# EAGLE design UP_Aktor_1Wechsler_16A_V0.1 (EAGLE 6.4)
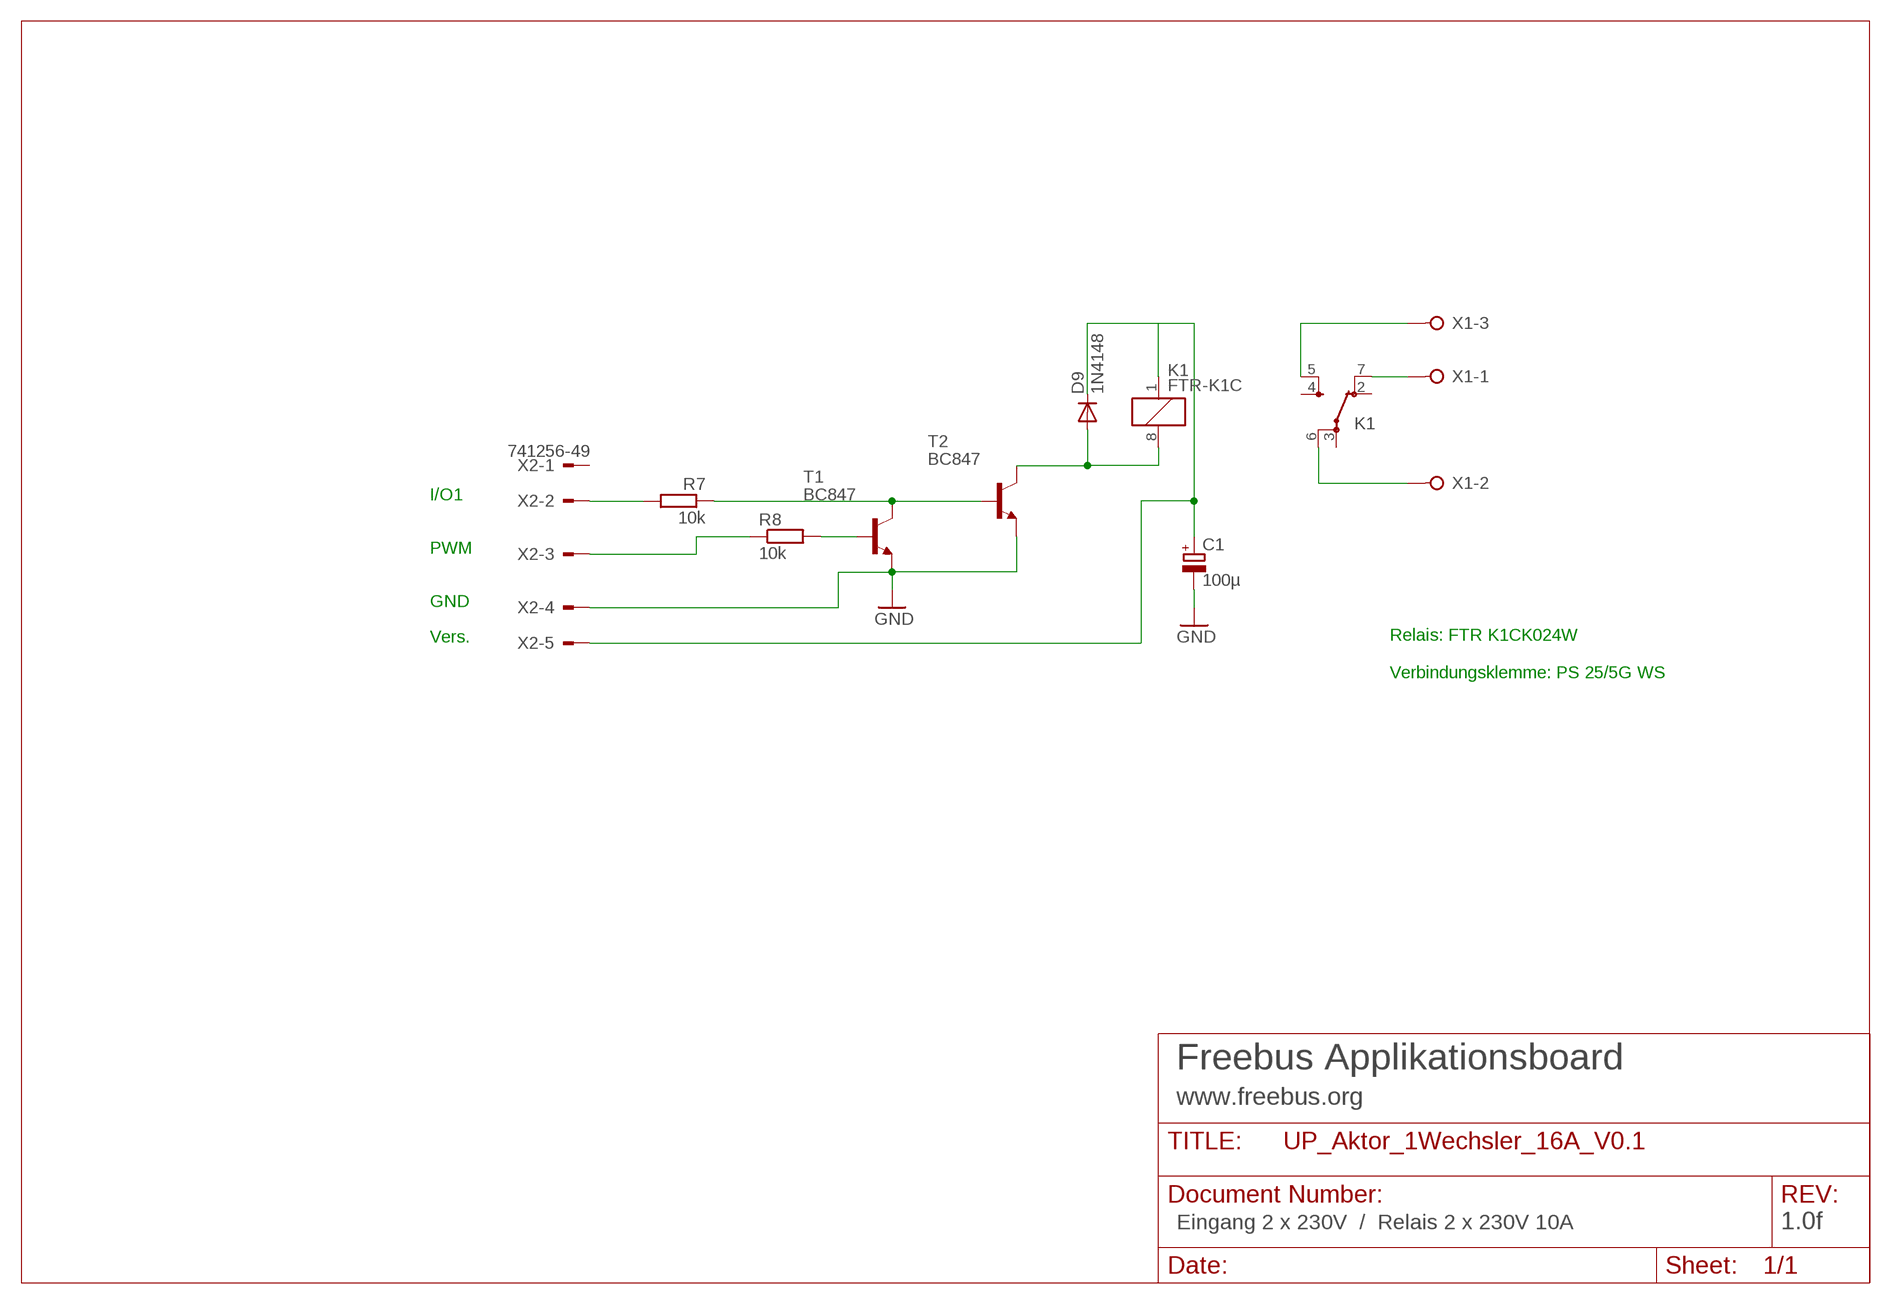
[diagram p0: schematic, sheet 1]

## Parts
C1  100µ  CPOL-EUE3.5-8  [E3,5-8]
D9  1N4148  DIODE-MINIMELF  [MINIMELF]
K1  FTR-K1C  [FTR-K1C]
R7  10k  R-EU_M1206  [M1206]
R8  10k  R-EU_M1206  [M1206]
T1  BC847  [SOT23]
T2  BC847  [SOT23]
X1  W237-03P  [W237-133]
X2  741256-49  [741256-49]

## Nets
GND: C1.- T1.2(E) T2.2(E) X2.4
IO2: R7.2 X2.2
N$1: K1.5(-1:SB) X1.3
N$2: K1.7(-1:OB) X1.1
N$3: K1.6(-1:PB) X1.2
N$7: R8.1 X2.3
N$14: R7.1 T1.3(C) T2.1(B)
N$21: R8.2 T1.1(B)
R3: D9.A K1.8 T2.3(C)
VDD_IN: C1.+ D9.C K1.1 X2.5
Unconnected: K1.2(-1:OA) K1.3(-1:PA) K1.4(-1:SA) X2.1

## Notes on the sheet
- I/O1
- PWM
- GND
- Vers.
- Relais: FTR K1CK024W
  
  Verbindungsklemme: PS 25/5G WS
- Freebus Applikationsboard
- www.freebus.org
- Eingang 2 x 230V  /  Relais 2 x 230V 10A | 1.0f

## Library data of the parts
C1 = rcl:CPOL-EU: POLARIZED CAPACITOR, European symbol
D9 = diode:DIODE-: DIODE
K1 = relay:FTR-K1C: NETZRELAIS FTR-K1CK024W1XUM 16A/250VAC 1 Umschaltkontakt Distributor: Conrad Electronic Bestell Nr.: 504389-13 - 24V Source: http://www.produktinfo.conrad.com/datenblaetter/500000-524999/504384-da-01-de-NETZRELAIS_FTR_K1CK012W1XUM_16A_250VAC.pdf; OC_FARNELL: unknown; OC_NEWARK: unknown
R7 R8 = rcl:R-EU_: RESISTOR, European symbol
T1 T2 = transistor:BC847: NPN TRANSISTOR
X1 = con-wago-508:W237-03P: WAGO SREW CLAMP; OC_FARNELL: unknown; OC_NEWARK: unknown
X2 = con-conrad:741256-49: Connector with Kabel

## Board
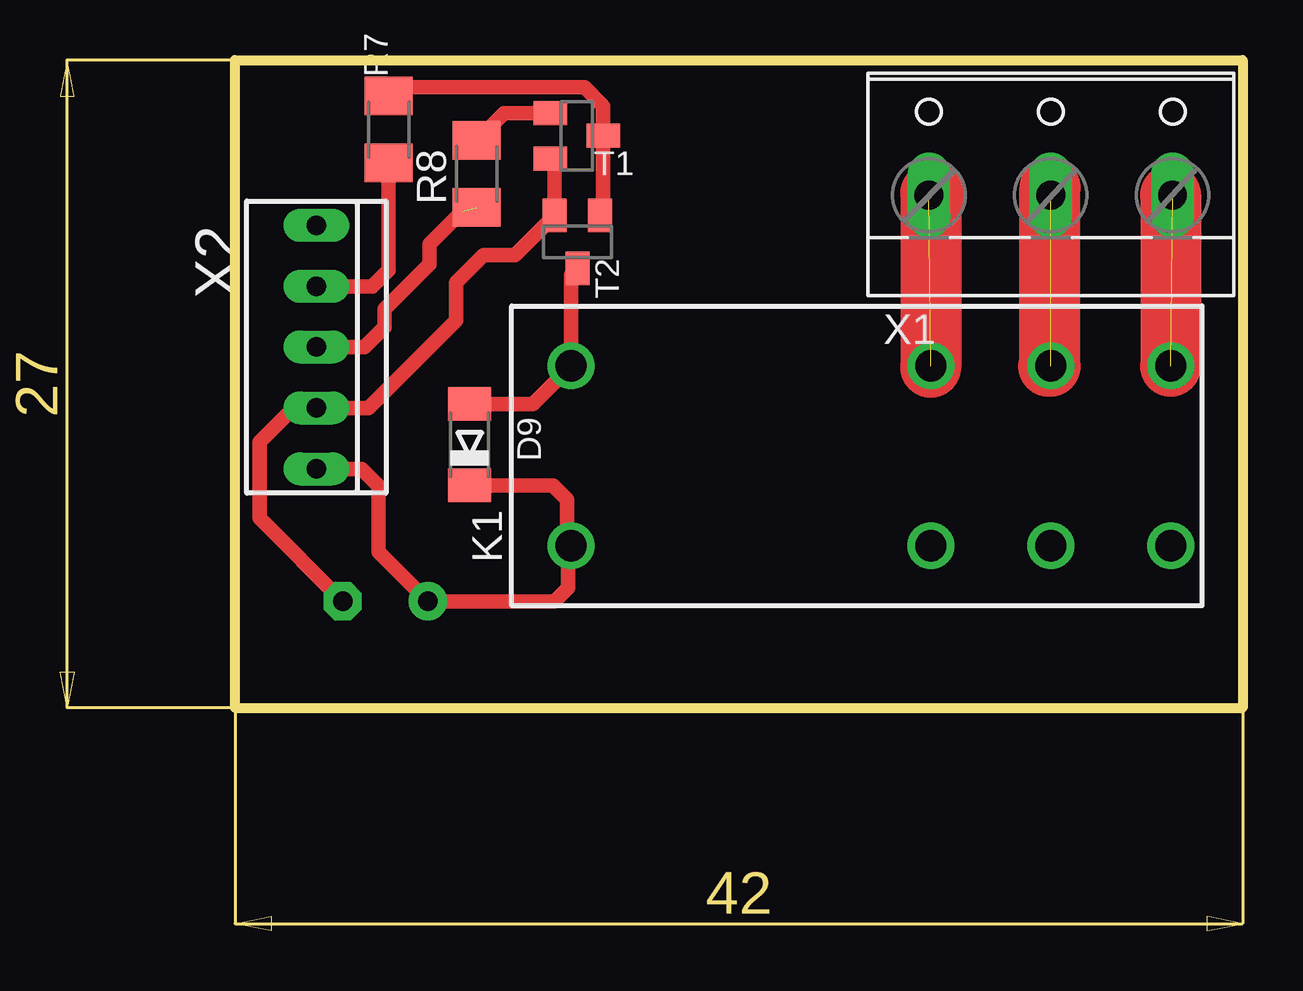
[diagram p1: board, top side]
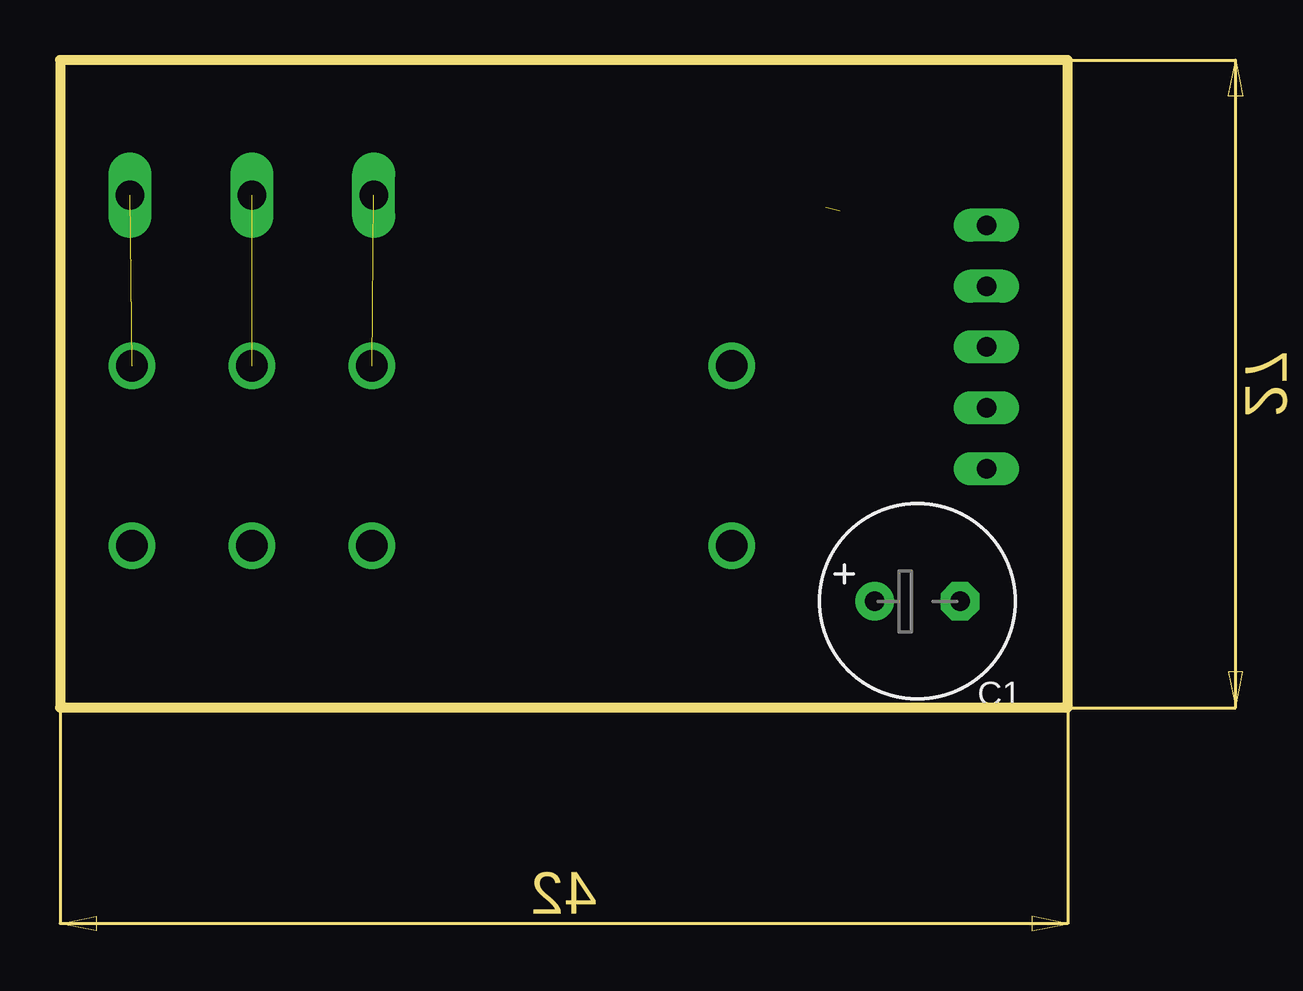
[diagram p2: board, bottom side, seen from below]

Size 42 x 27 mm. Coordinates in mm from the lower left corner, seen from the top.
Outline: 0,0 42,0 42,27 0,27 0,0
Copper layers (1*16): Top 0.035mm / dielectric 1.5mm / Bottom 0.035mm
Design rules "default_freebus": minimum track width 10mil, minimum drill 24mil, track to track 8mil, track to pad 8mil, pad to pad 8mil, via to via 8mil, smd to smd 8mil, copper to edge 12mil, drill to drill 8mil, minimum pad ring 11mil, minimum via ring 8mil, stop-mask expansion 4mil, vias tented up to drill 0mil, thermal gap 10mil

### Footprints (pad centres in the part's own frame; a part is rotated, then mirrored left to right if it is on the bottom)
E3,5-8 = drill 0.813 pad 1.6: + -1.778,0 | drill 0.813 pad 1.6 octagon: - 1.778,0
MINIMELF = smd 1.4 x 1.8: A 1.7,0; C -1.7,0
FTR-K1C = drill 1.3 pad 1.93: 1 -12.5,-3.75; 2 2.5,-3.75; 3 7.5,-3.75; 4 12.5,-3.75; 5 12.5,3.75; 6 7.5,3.75; 7 2.5,3.75; 8 -12.5,3.75
M1206 = smd 1.6 x 2: 1 -1.4,0; 2 1.4,0
SOT23 = smd 1 x 1.4: 1 -0.95,-1.1; 2 0.95,-1.1; 3 0,1.1
W237-133 = drill 1.194 long: 1 -5.08,-0.635; 2 0,-0.635; 3 5.08,-0.635
741256-49 = drill 0.813 pad 1.27 long: 1 -8.89,0; 2 -6.35,0; 3 -3.81,0; 4 -1.27,0; 5 1.27,0

### Placement (x,y rotation side)
C1  6.26,4.43 0 bottom
D9  9.78,10.97 90 top
K1  26.5,10.5 0 top
R7  6.4,24.1 270 top
R8  10.07,22.25 90 top
T1  14.25,23.84 270 top
T2  14.27,19.42 180 top
X1  34,22 0 top
X2  3.38,11.22 270 top

### Tracks (layer width: path | path; a pad name or v marks a point on that pad's centre or on a via)
GND
  Top 0.61: T1.2 13.32,22.71 T2.2 11.67,18.87 10.35,18.87 9.21,17.73 9.21,16.14 5.56,12.49 X2.4 2.44,12.49 1.02,11.07 1.02,7.9 C1.-
IO2
  Top 0.61: R7.2 6.41,18.25 5.71,17.55 3.4,17.55 X2.2
N$1  (1 unrouted)
N$2  (1 unrouted)
N$3  (1 unrouted)
N$4
  Top 2.54: 29.15,21.43 29,21.43 29,14.18
N$5
  Top 2.54: 33.92,14.23 33.97,14.23 33.97,21.7
N$6
  Top 2.54: 39,21.38 39,14.22
N$7  (1 unrouted)
  Top 0.61: X2.3 5.4,15.03 6.23,15.86 6.23,16.62 8.1,18.49 8.1,19.32 9.48,20.71
N$14
  Top 0.61: T2.1 15.35,20.65 T1.3 15.35,25.08 14.56,25.87 6.77,25.87 R7.1
N$21
  Top 0.61: R8.2 11.21,24.79 T1.1
R3
  Top 0.61: T2.3 14,18.05 K1.8 12.42,12.67 D9.A
VDD_IN
  Top 0.61: D9.C 13.24,9.27 13.83,8.68 13.83,6.92 K1.1 13.87,6.62 13.87,4.98 13.32,4.43 C1.+ 5.98,6.49 5.98,9.23 5.26,9.95 X2.5